# Altium project FM-Transmitter.PrjPcb
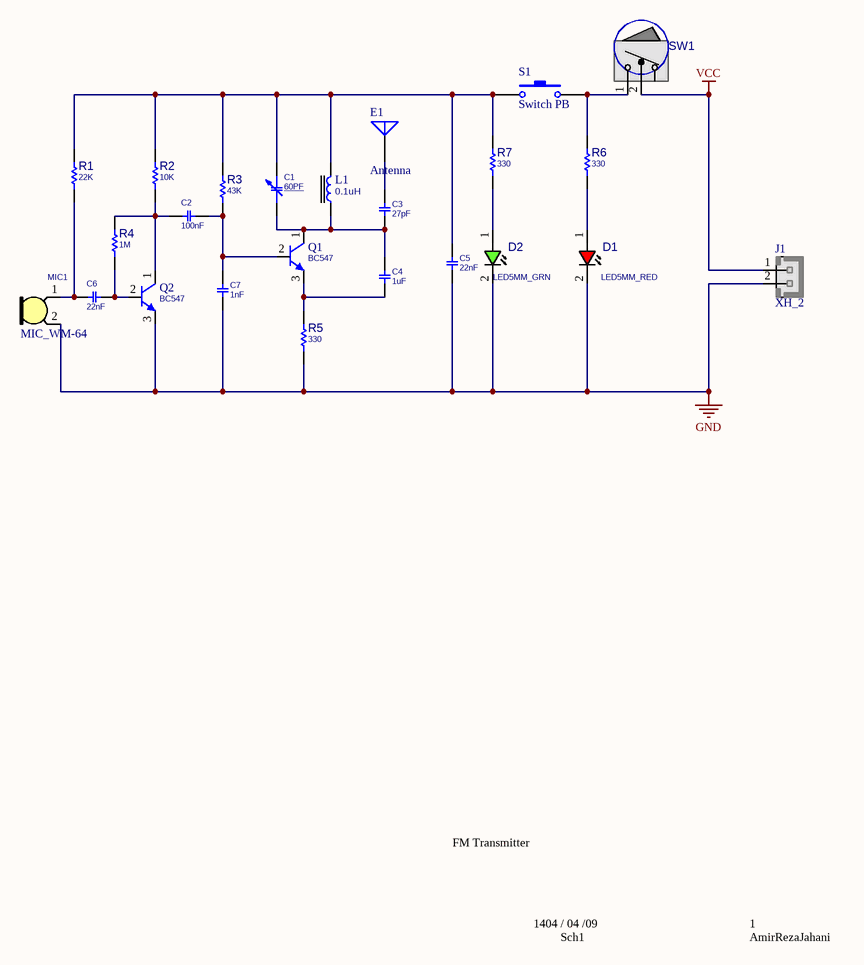
[diagram p0: Sheet1.SchDoc]
1 sheet, 24 parts. Net scope: global (net labels, ports and power ports of the same name join across sheets).
Board file: PCB1.PcbDoc

## Sheet Sheet1.SchDoc
size A4; SheetNumber: 1; SheetTotal: 1

### Parts
C1  60PF  [CTRM_6X6]
C2  100nF  [C_CER_D5]
C3  27pF  [C_CER_D5]
C4  1uF  [C_CER_D5]
C5  22nF  [C_CER_D5]
C6  22nF  [C_CER_D5]
C7  1nF  [C_CER_D5]
D1  LED5MM_RED  [LED5MM_RED]
D2  LED5MM_GRN  [LED5MM_GRN]
E1  Antenna  [PIN1]
J1  XH_2  [XH_2]
L1  0.1uH  [LT_AX025]
MIC1  MIC_WM-64  [MIC_C6]
Q1  BC547  [TO92_3]
Q2  BC547  [TO92_3]
R1  22K  [R025W_AX04]
R2  10K  [R025W_AX04]
R3  43K  [R025W_AX04]
R4  1M  [R025W_AX04]
R5  330  [R025W_AX04]
R6  330  [R025W_AX04]
R7  330  [R025W_AX04]
S1  Switch PB  [Switch - Push to On]
SW1  ToggleSwitch  [SWRCK_SPST_S_15X10]  (value not drawn)

### Nets
GND: C5.1 C7.1 D1.2(CATHODE) D2.2(CATHODE) J1.2 MIC1.2(GND) Q2.3(E) R5.1
VCC: J1.1 SW1.2(COM)
NetC1_1: C1.1 C3.1 C4.2 L1.1 Q1.1(C)
NetC1_2: C1.2 C5.2 L1.2 R1.2 R2.2 R3.2 R7.2 S1.1
NetC2_1: C2.1 Q2.1(C) R2.1 R4.2
NetC2_2: C2.2 C7.2 Q1.2(B) R3.1
NetC3_2: C3.2 E1.1(A)
NetC4_1: C4.1 Q1.3(E) R5.2
NetC6_1: C6.1 MIC1.1(OUT) R1.1
NetC6_2: C6.2 Q2.2(B) R4.1
NetD1_1: D1.1(ANODE) R6.1
NetD2_1: D2.1(ANODE) R7.1
NetR6_2: R6.2 S1.2 SW1.1(T1)

### Notes on the sheet
- FM Transmitter
- 1404 / 04 /09
- 1
- Sch1
- AmirRezaJahani

### Library data of the parts
C1 = CAP_THD_TRIMMER: CAP, THD, TRIMMER; DESC: CAP, SMD, TRIMMER; MANF_P#: MANF_PART#; PARAM: PARAM; PRICE: 100= 1$; MANF: MANF; PARAM2: PARAM2; ASSEMBLY: ASSEMBLY; VALUE: 60PF
C2-C7 = CAP_THD_CER: CAP, THD, CER MULTI LAYER,; DESC: CAP, CER MULTI LAYER,; MANF_P#: MANF_PART#; PARAM2: 50V; PRICE: 100= 1$; MANF: MANF; ASSEMBLY: ASSEMBLY
  C2: VALUE: 100nF
  C3: VALUE: 27pF
  C4: VALUE: 1uF
  C5 C6: VALUE: 22nF
  C7: VALUE: 1nF
D1 = LED_THD_5MM_RED: LED, THD, 5MM, RED; DESC: DESCRIPTION; MANF_P#: MANF_PART#; PARAM2: 2.2V; MANF: MANF; ASSEMBLY: ASSEMBLY; PRICE: PRICE; VALUE: LED5MM_RED
D2 = LED_THD_5MM_GRN: LED, THD, 5MM, GREEN; DESC: DESCRIPTION; MANF_P#: MANF_PART#; PARAM2: 2.2V; MANF: MANF; ASSEMBLY: ASSEMBLY; PRICE: PRICE; VALUE: LED5MM_GRN
E1 = Antenna: Generic Antenna; Published: 24-Mar-1999; LatestRevisionDate: 17-Jul-2002; LatestRevisionNote: Re-released for DXP Platform.; PackageReference: PIN1; Publisher: Altium Limited
J1 = XH_2: PW10-x-M, JST-BxB-XH-A pitch: 2.5mm, 3A/250v; MANF: JST; MANF_P#: B2B-XH-A; PARAM2: 250v; PARAM: 3.0A; VALUE: XH_2
L1 = IND_THD: INDUCTOR, THD; VALUE: 0.1uH
MIC1 = MIC_WM-64: MICROPHONE OMNI 6X2.2MM W/CAP 2.2KOHM -44DB TH; MANF_P#: WM-64PNT; PRICE: PRICE; Value: MIC_WM-64
Q1 Q2 = NPN_BC547_TO92: BJT, NPN, 45v, 0.1A, THD, TO92; PARAM: 0.1A, Hfe110~800; PARAM2: 45v, 500mW; MANF: FAIRCHILD; MANF_P#: BC547; VALUE: BC547
R1-R7 = RES_THD: RESISTOR, THD; MANF_P#: RK73H1ETTP4701F; MANF: KOA SPEER; PARAM: 0.063W; DESC: DESCRIPTION; DIST#: MOUSER; PARAM2: 1%; ASSEMBLY: ASSEMBLY; PRICE: 100= 0.5$
  R1: VALUE: 22K
  R2: VALUE: 10K
  R3: VALUE: 43K
  R4: VALUE: 1M
  R5-R7: VALUE: 330
S1 = Switch PB: Push Button Switch
SW1 = SWROK_SPST_R_15X10: SWITCH, Rocker, SPST, THD, 15x10.5mm; DESC: DESCRIPTION; MANF: -; MANF_PART#: -; VALUE: ToggleSwitch; ASSEMBLY: ASSEMBLY; PARAM: -; PRICE: -